# EAGLE schematic stm32f103cbt6 eagle (EAGLE 7.5.0)
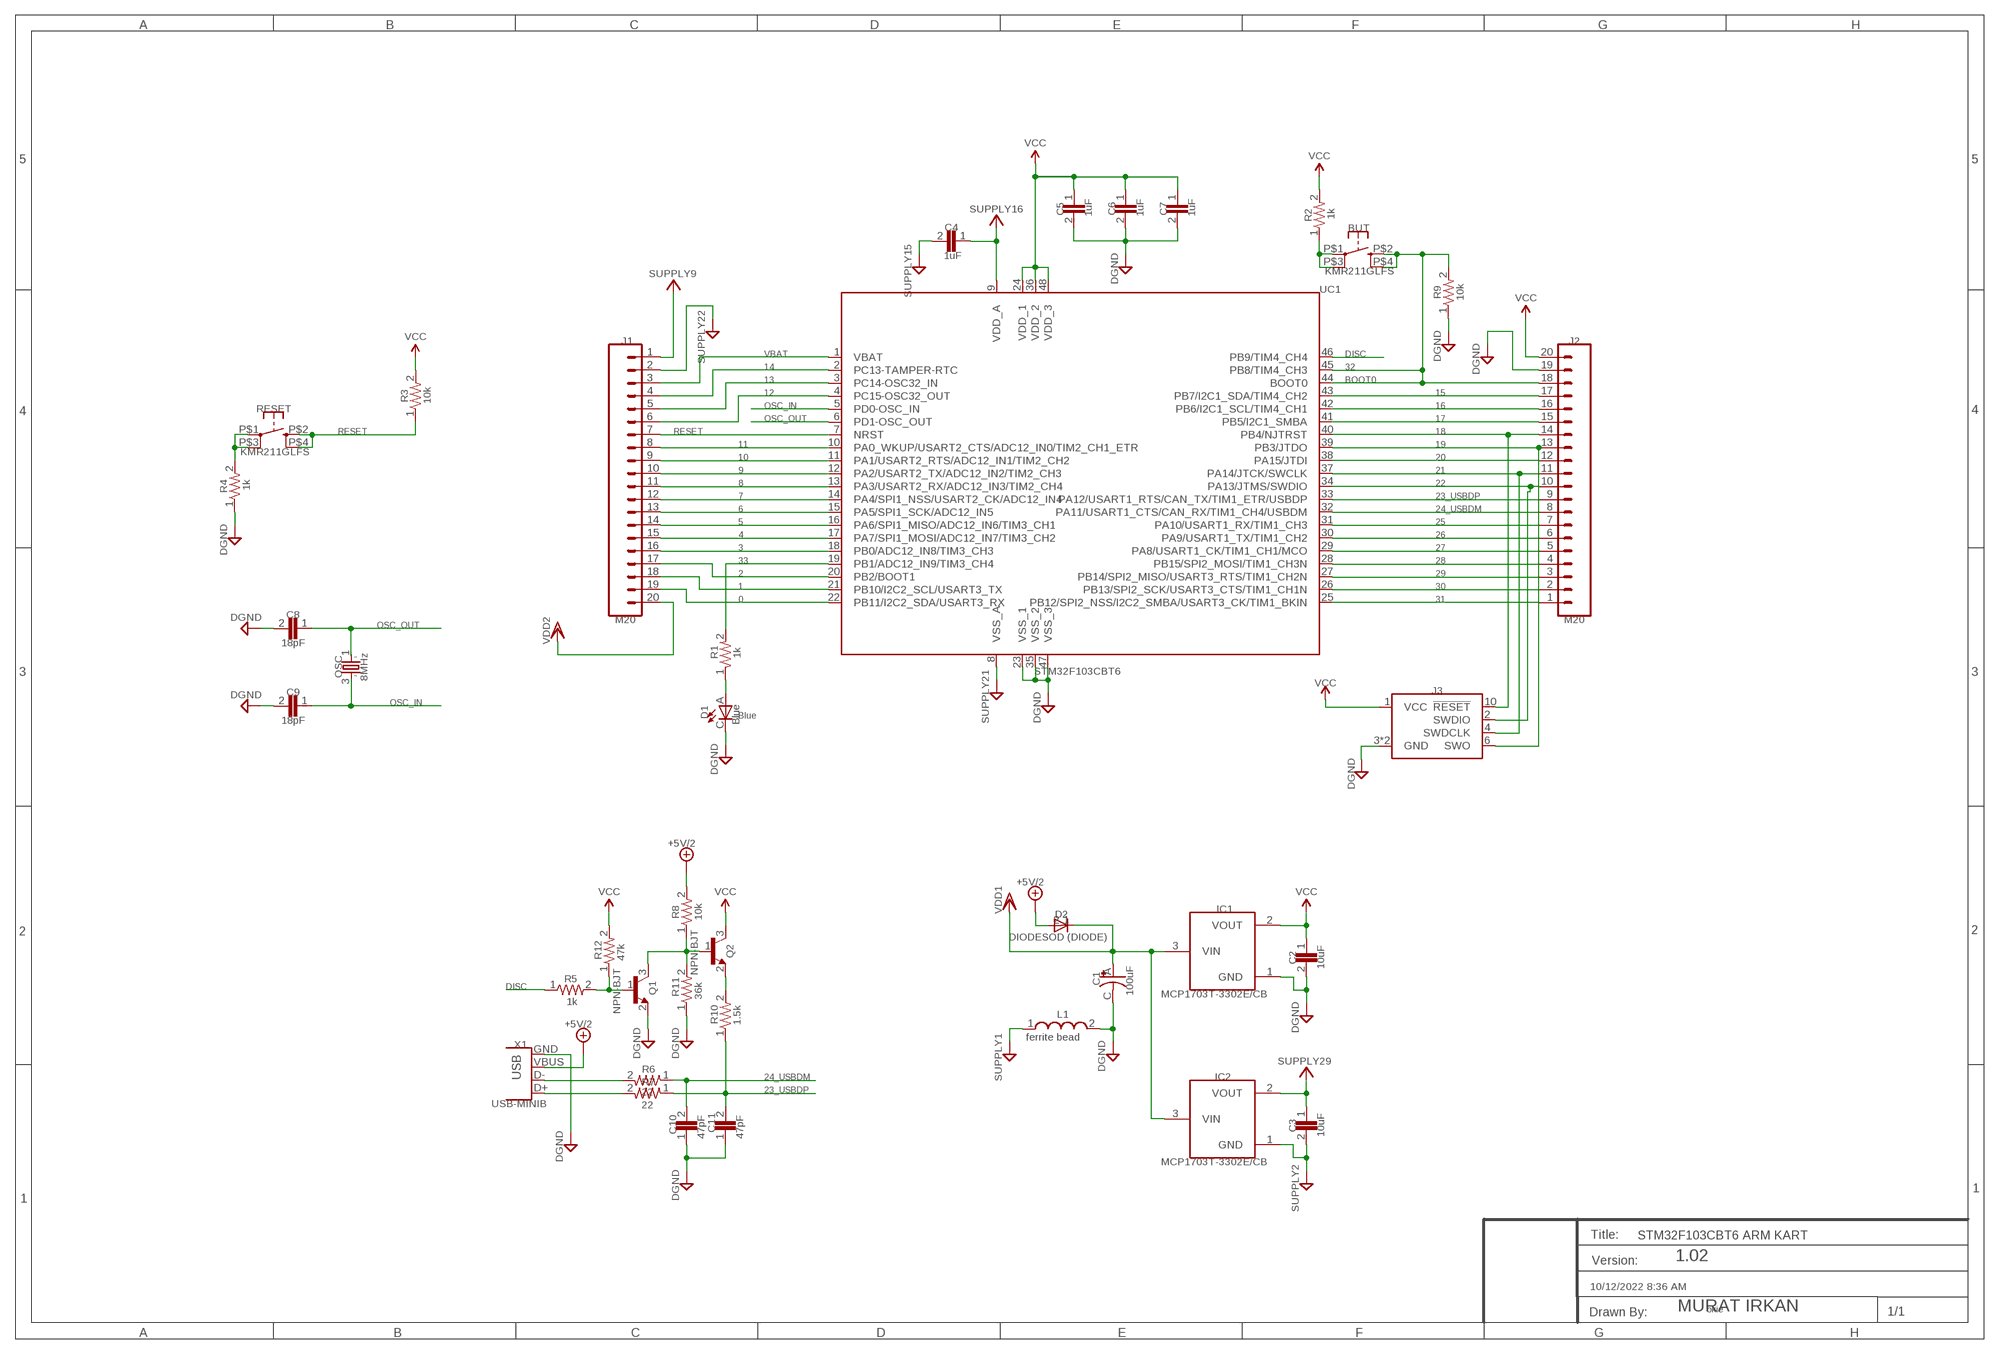
[diagram p0: schematic, sheet 1]

## Parts
BUT  KMR211GLFS  BUTTON-KMR241GLFS  [PUSHBUTTON-KMR241GLFS]
C1  100uF  CAP_POL1206_(CAP_POL)  [EIA3216]
C2  10uF  CAP0805_(CAP)  [0805]
C3  10uF  CAP0805_(CAP)  [0805]
C4  1uF  CAP0402_(CAP)  [C0402]
C5  1uF  CAP0402_(CAP)_17  [C0402]
C6  1uF  CAP0402_(CAP)_17  [C0402]
C7  1uF  CAP0402_(CAP)_17  [C0402]
C8  18pF  CAP0402_(CAP)  [C0402]
C9  18pF  CAP0402_(CAP)  [C0402]
C10  47pF  CAP0402_(CAP)_18  [C0402]
C11  47pF  CAP0402_(CAP)_18  [C0402]
D1  Blue  LED1206_(LED)  [LED-1206]
D2  DIODESOD_(DIODE)  [SOD-323]
IC1  MCP1703T-3302E/CB  MCP1700T  [SOT23]
IC2  MCP1703T-3302E/CB  MCP1700T  [SOT23]
J1  M20  [1X20]
J2  M20  [1X20]
J3  CORTEX_DEBUG  CORTEX_JTAG_DEBUG_MINIMUM_PTH_NS_(CORTEX_JTAG_DEBUG_MINIMUM)  [2X5-PTH-1.27MM-NO_SILK]
L1  ferrite bead  INDUCTOR0603_(INDUCTOR)  [0603]
OSC  8MHz  CRYSTAL5X3_(CRYSTAL)  [CRYSTAL-SMD-5X3]
Q1  NPN-BJT  TRANSISTOR_NPNSOT23_(TRANSISTOR_NPN)  [SOT23_21]
Q2  NPN-BJT  TRANSISTOR_NPNSOT23_(TRANSISTOR_NPN)  [SOT23_21]
R1  1k  RESISTOR0402_(RESISTOR)  [C0402]
R2  1k  RESISTOR0402_(RESISTOR)_6  [C0402]
R3  10k  RESISTOR0402_(RESISTOR)_6  [C0402]
R4  1k  RESISTOR0402_(RESISTOR)_6  [C0402]
R5  1k  RESISTOR0402_(RESISTOR)_6  [C0402]
R6  22  RESISTOR0402_(RESISTOR)_7  [C0402]
R7  22  RESISTOR0402_(RESISTOR)_7  [C0402]
R8  10k  RESISTOR0402_(RESISTOR)_6  [C0402]
R9  10k  RESISTOR0402_(RESISTOR)_6  [C0402]
R10  1.5k  RESISTOR0402_(RESISTOR)_6  [C0402]
R11  36k  RESISTOR0402_(RESISTOR)_6  [C0402]
R12  47k  RESISTOR0402_(RESISTOR)_6  [C0402]
RESET  KMR211GLFS  BUTTON-KMR241GLFS  [PUSHBUTTON-KMR241GLFS]
UC1  STM32F103CBT6  STM32F103CB  [LQFP48]
X1  USB-MINIB  USBSMD_(USB)  [USB-MINIB]

## Nets
0: J1.19 UC1.22(PB11/I2C2_SDA/USART3_RX)
1: J1.18 UC1.21(PB10/I2C2_SCL/USART3_TX)
2: J1.17 UC1.20(PB2/BOOT1)
3: J1.16 UC1.18(PB0/ADC12_IN8/TIM3_CH3)
4: J1.15 UC1.17(PA7/SPI1_MOSI/ADC12_IN7/TIM3_CH2)
5: J1.14 UC1.16(PA6/SPI1_MISO/ADC12_IN6/TIM3_CH1)
6: J1.13 UC1.15(PA5/SPI1_SCK/ADC12_IN5)
7: J1.12 UC1.14(PA4/SPI1_NSS/USART2_CK/ADC12_IN4)
8: J1.11 UC1.13(PA3/USART2_RX/ADC12_IN3/TIM2_CH4)
9: J1.10 UC1.12(PA2/USART2_TX/ADC12_IN2/TIM2_CH3)
10: J1.9 UC1.11(PA1/USART2_RTS/ADC12_IN1/TIM2_CH2)
11: J1.8 UC1.10(PA0_WKUP/USART2_CTS/ADC12_IN0/TIM2_CH1_ETR)
12: J1.6 UC1.4(PC15-OSC32_OUT)
13: J1.5 UC1.3(PC14-OSC32_IN)
14: J1.4 UC1.2(PC13-TAMPER-RTC)
15: J2.17 UC1.43(PB7/I2C1_SDA/TIM4_CH2)
16: J2.16 UC1.42(PB6/I2C1_SCL/TIM4_CH1)
17: J2.15 UC1.41(PB5/I2C1_SMBA)
18: J2.14 J3.10(!RESET) UC1.40(PB4/NJTRST)
19: J2.13 J3.6(SWO) UC1.39(PB3/JTDO)
20: J2.12 UC1.38(PA15/JTDI)
21: J2.11 J3.4(SWDCLK) UC1.37(PA14/JTCK/SWCLK)
22: J2.10 J3.2(SWDIO) UC1.34(PA13/JTMS/SWDIO)
23_USBDP: C11.2 J2.9 R7.1 R10.1 UC1.33(PA12/USART1_RTS/CAN_TX/TIM1_ETR/USBDP)
24_USBDM: C10.2 J2.8 R6.1 UC1.32(PA11/USART1_CTS/CAN_RX/TIM1_CH4/USBDM)
25: J2.7 UC1.31(PA10/USART1_RX/TIM1_CH3)
26: J2.6 UC1.30(PA9/USART1_TX/TIM1_CH2)
27: J2.5 UC1.29(PA8/USART1_CK/TIM1_CH1/MCO)
28: J2.4 UC1.28(PB15/SPI2_MOSI/TIM1_CH3N)
29: J2.3 UC1.27(PB14/SPI2_MISO/USART3_RTS/TIM1_CH2N)
30: J2.2 UC1.26(PB13/SPI2_SCK/USART3_CTS/TIM1_CH1N)
31: J2.1 UC1.25(PB12/SPI2_NSS/I2C2_SMBA/USART3_CK/TIM1_BKIN)
32: BUT.P$2 BUT.P$4 J2.18 R9.2 UC1.44(BOOT0) UC1.45(PB8/TIM4_CH3)
33: R1.2 UC1.19(PB1/ADC12_IN9/TIM3_CH4)
+5V/2: D2.2(A) R8.2 X1.VBUS ; supply symbol labelled USB_5V
AV+: C3.1 C4.1 IC2.2(VOUT) J1.1 UC1.9(VDD_A)
AV-: C3.2 C4.2 IC2.1(GND) J1.2 L1.1 UC1.8(VSS_A)
DGND: C1.C(-) C2.2 C5.2 C6.2 C7.2 C8.2 C9.2 C10.1 C11.1 D1.C IC1.1(GND) J2.19 J3.3(GND) J3.5(GND) L1.2 Q1.2(E) R4.1 R9.1 R11.1 UC1.23(VSS_1) UC1.35(VSS_2) UC1.47(VSS_3) X1.GND ; supply symbol labelled GND
DISC: R5.1 UC1.46(PB9/TIM4_CH4)
N$1: BUT.P$1 BUT.P$3 R2.1
N$2: D1.A R1.1
N$4: R4.2 RESET.P$1 RESET.P$3
N$51: Q2.2(E) R10.2
N$59: R6.2 X1.D-
N$60: R7.2 X1.D+
N$71: Q1.3(C) Q2.1(B) R8.1 R11.2
N$73: Q1.1(B) R5.2 R12.1
OSC_IN: C9.1 OSC.3 UC1.5(PD0-OSC_IN)
OSC_OUT: C8.1 OSC.1 UC1.6(PD1-OSC_OUT)
RESET: J1.7 R3.1 RESET.P$2 RESET.P$4 UC1.7(NRST)
VBAT: J1.3 UC1.1(VBAT)
VCC: C2.1 C5.1 C6.1 C7.1 IC1.2(VOUT) J2.20 J3.1(VCC) Q2.3(C) R2.2 R3.2 R12.2 UC1.24(VDD_1) UC1.36(VDD_2) UC1.48(VDD_3) ; supply symbol labelled VCC_11
VIN: C1.A(+) D2.1(C) IC1.3(VIN) IC2.3(VIN) J1.20

## Notes on the sheet
- A | B | C | D | E | F | G | H
- VCC
- VCC
- 5 | 5
- SUPPLY16 | C5 | C6 | C7
- 1uF | 1uF | 1uF | 1k
- R2
- C4 | BUT
- 1uF
- KMR211GLFS
- SUPPLY9
- DGND
- UC1
- SUPPLY15 | R9
- 10k | VCC
- VCC
- J1 | J2
- VBAT | DISC
- SUPPLY22 | DGND
- 14 | 32
- DGND
- 13 | BOOT0
- 12 | 15
- R3 | 10k
- OSC_IN | 16
- RESET | 4
- 4
- OSC_OUT | 17
- RESET | RESET | 18
- KMR211GLFS | 11 | 19
- 10 | 20
- 9 | 21
- 8 | 22
- R4 | 1k
- 7 | 23_USBDP
- 6 | 24_USBDM
- 5 | 25
- 4 | 26
- 3 | 27
- DGND
- 33 | 28
- 2 | 29
- 1 | 30
- 0 | 31
- C8 | M20 | M20
- DGND
- OSC_OUT
- 18pF
- VDD2
- 1
- R1 | 1k
- STM32F103CBT6
- 2
- 3 | OSC | 3
- 8MHz
- VCC
- C9 | J3
- DGND
- OSC_IN
- 18pF
- D1 | Blue
- Blue | SUPPLY21 | DGND
- DGND
- DGND
- +5V/2
- +5V/2
- VCC | VCC | VCC
- VDD1 | IC1
- R8 | 10k | D2
- 2 | DIODESOD (DIODE) | 2
- R12 | Q2
- 47k
- C2
- 10uF
- NPN-BJT
- R5
- C1
- DISC | MCP1703T-3302E/CB
- 1k | Q1 | R11 | 100uF
- 36k
- NPN-BJT
- L1
- R10 | 1.5k
- +5V/2
- ferrite bead | DGND
- X1
- USB
- DGND | DGND
- SUPPLY29
- R6 | DGND
- 24_USBDM | SUPPLY1 | IC2
- 22 | R7
- 23_USBDP
- USB-MINIB | 22
- C10 | C11 | C3
- 47pF | 47pF | 10uF
- MCP1703T-3302E/CB
- DGND
- 1
- 1 | DGND
- SUPPLY2
- Title: | STM32F103CBT6 ARM KART
- 1.02
- Version:
- 10/12/2022 8:36 AM
- MURAT IRKAN
- okie
- Drawn By: | 1/1
- A | B | C | D | E | F | G | H

## Library data of the parts
BUT RESET = common:BUTTON-KMR241GLFS
C1 = common:CAP_POL1206_(CAP_POL)
C2 C3 = common:CAP0805_(CAP)
C4 = common:CAP0402_(CAP)
C5-C7 = common:CAP0402_(CAP)_17
C8 C9 = common:CAP0402_(CAP); VALUE: 1uF
C10 C11 = common:CAP0402_(CAP)_18
D1 = common:LED1206_(LED)
D2 = common:DIODESOD_(DIODE)
IC1 IC2 = common:MCP1700T
J1 J2 = common:M20
J3 = common:CORTEX_JTAG_DEBUG_MINIMUM_PTH_NS_(CORTEX_JTAG_DEBUG_MINIMUM)
L1 = common:INDUCTOR0603_(INDUCTOR)
OSC = common:CRYSTAL5X3_(CRYSTAL)
Q1 Q2 = common:TRANSISTOR_NPNSOT23_(TRANSISTOR_NPN)
R1 = common:RESISTOR0402_(RESISTOR)
R2 R4 R5 = common:RESISTOR0402_(RESISTOR)_6
R3 R8-R12 = common:RESISTOR0402_(RESISTOR)_6; VALUE: 1k
R6 R7 = common:RESISTOR0402_(RESISTOR)_7
UC1 = common:STM32F103CB
X1 = common:USBSMD_(USB)

## Net classes
1 vcc: width 0.254 mm